# Altium schematic sheet 07_CAN.SchDoc
size 420 x 297 mm; SheetNumber: 12; SheetTotal: 36
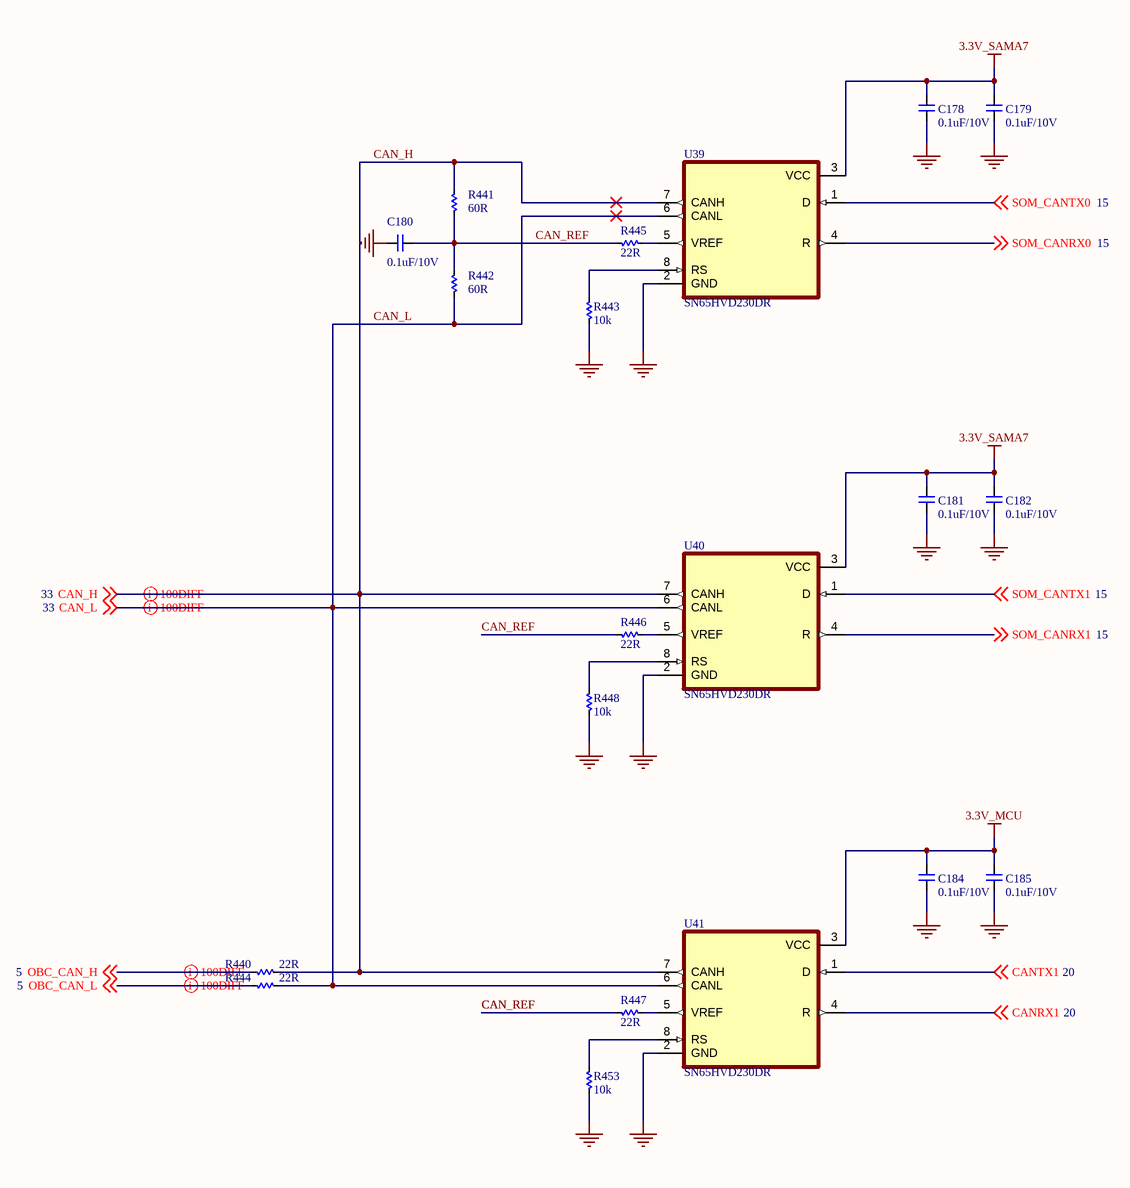
[diagram p0: 07_CAN.SchDoc]

## Parts
C178  0.1uF/10V  [CAP_C_1005X60]
C179  0.1uF/10V  [CAP_C_1005X60]
C180  0.1uF/10V  [CAP_C_1005X60]
C181  0.1uF/10V  [CAP_C_1005X60]
C182  0.1uF/10V  [CAP_C_1005X60]
C184  0.1uF/10V  [CAP_C_1005X60]
C185  0.1uF/10V  [CAP_C_1005X60]
R440  22R  [RES_C_1005X40]
R441  60R  [RES_C_1005X40]
R442  60R  [RES_C_1005X40]
R443  10k  [RES_C_1005X40]
R444  22R  [RES_C_1005X40]
R445  22R  [RES_C_1005X40]
R446  22R  [RES_C_1005X40]
R447  22R  [RES_C_1005X40]
R448  10k  [RES_C_1005X40]
R453  10k  [RES_C_1005X40]
U39  SN65HVD230DR  [SOIC127P600X175-8N]
U40  SN65HVD230DR  [SOIC127P600X175-8N]
U41  SN65HVD230DR  [SOIC127P600X175-8N]

## Nets
3.3V_MCU: C184.1 C185.1 U41.3(VCC)
3.3V_SAMA7: C178.1 C179.1 C181.1 C182.1 U39.3(VCC) U40.3(VCC)
GND: C178.2 C179.2 C180.2 C181.2 C182.2 C184.2 C185.2 R443.1 R448.1 R453.1 U39.2(GND) U40.2(GND) U41.2(GND)
CAN_H: R440.2 R441.2 U39.7(CANH) U40.7(CANH) U41.7(CANH) ; off-sheet CAN_H
CAN_L: R442.1 R444.2 U39.6(CANL) U40.6(CANL) U41.6(CANL) ; off-sheet CAN_L
CAN_REF: C180.1 R441.1 R442.2 R445.1 R446.1 R447.1
CANRX1: U41.4(R) ; off-sheet CANRX1
CANTX1: U41.1(D) ; off-sheet CANTX1
OBC_CAN_H: R440.1 ; off-sheet OBC_CAN_H
OBC_CAN_L: R444.1 ; off-sheet OBC_CAN_L
SOM_CANRX0: U39.4(R) ; off-sheet SOM_CANRX0
SOM_CANRX1: U40.4(R) ; off-sheet SOM_CANRX1
SOM_CANTX0: U39.1(D) ; off-sheet SOM_CANTX0
SOM_CANTX1: U40.1(D) ; off-sheet SOM_CANTX1
NetR443_2: R443.2 U39.8(RS)
NetR445_2: R445.2 U39.5(VREF)
NetR446_2: R446.2 U40.5(VREF)
NetR447_2: R447.2 U41.5(VREF)
NetR448_2: R448.2 U40.8(RS)
NetR453_2: R453.2 U41.8(RS)

## Layout directives
differential pair; differential pair class DIFF100: CAN_H, CAN_L, OBC_CAN_H, OBC_CAN_L

## Notes on the sheet
- Project:
- Sub-system:
- Design by:
- Sheet title:
- Sheet
- of
- Checked by:
- Approved by:
- Revision:
- Document No:
- Size:
- Date:
- A3

## Library data of the parts
C178-C182 C184 C185 = _CAP_C_2: CAP
R440-R448 R453 = _RES_B_2: RES
U39-U41 = SN65HVD230DR: 3.3 V CAN Transceiver with Standby Mode; MF: Texas Instruments; SnapEDA_Link: https://www.snapeda.com/parts/SN65HVD230DR/Texas+Instruments/view-part/?ref=snap; Package: SOIC-8 Texas Instruments; Value: *; MP: SN65HVD230DR; Check_prices: https://www.snapeda.com/parts/SN65HVD230DR/Texas+Instruments/view-part/?ref=eda